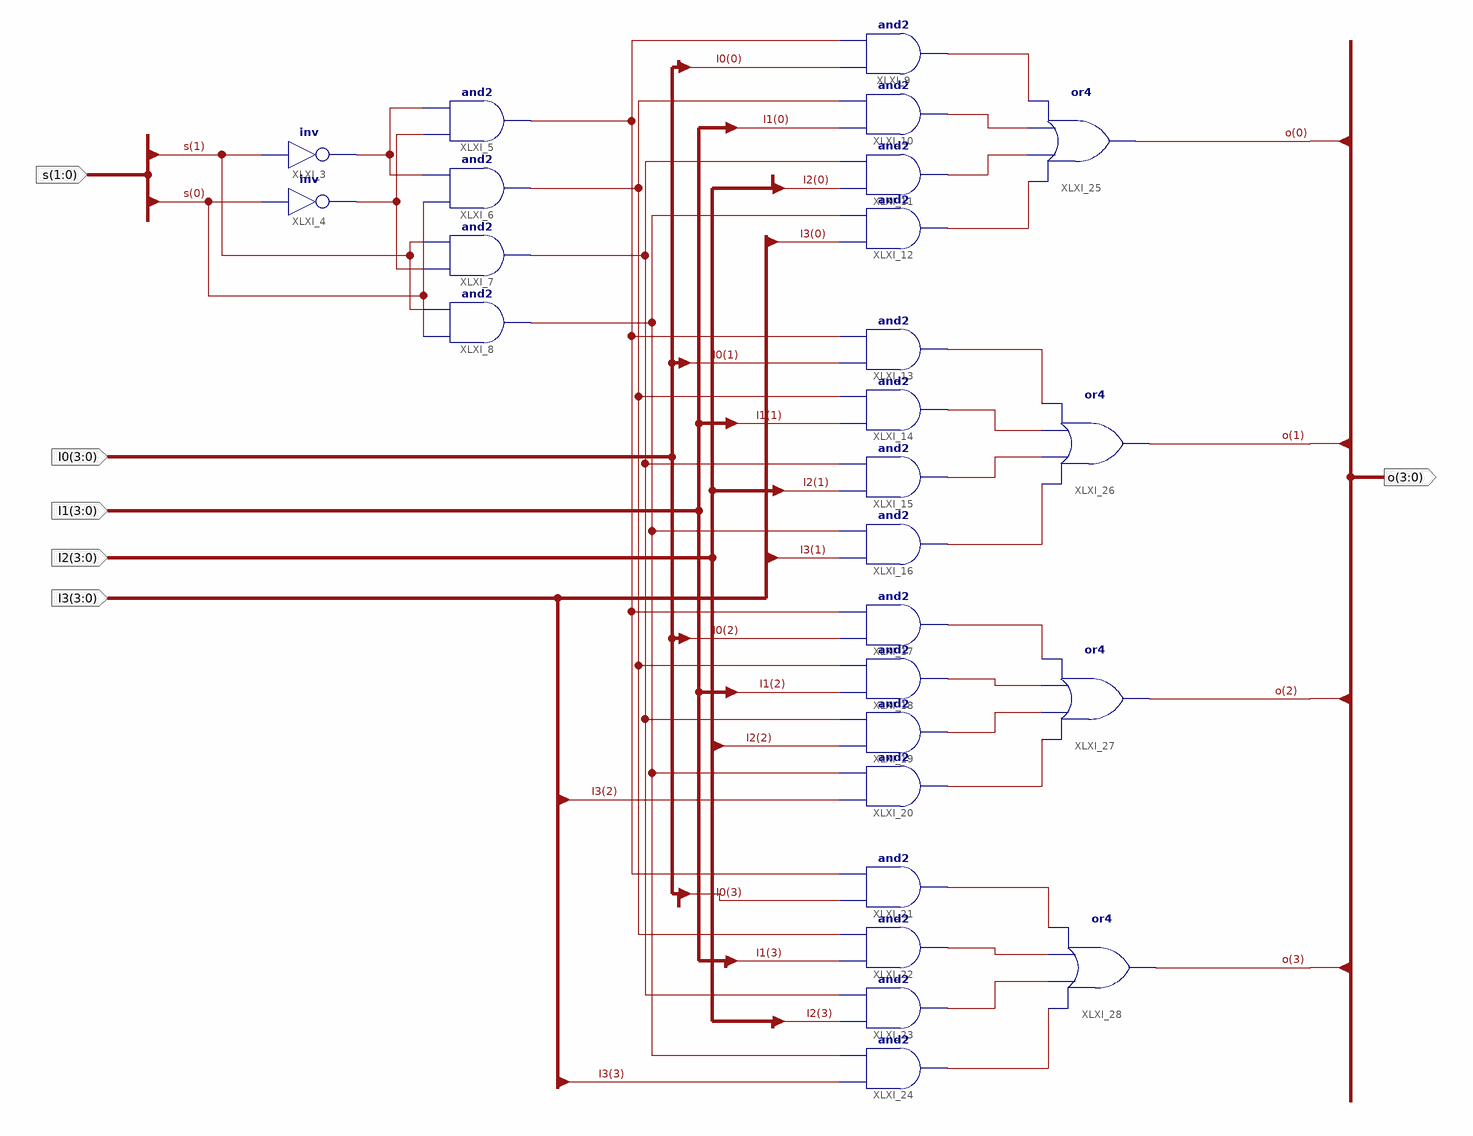
[diagram p0: schematic sheet 1]
// Xilinx ISE schematic MUX4T1_4.sch (kintex7) as structural Verilog: 26 symbols, 6 ports
module MUX4T1_4 (
  input  [1:0] s,
  input  [3:0] I1,
  input  [3:0] I2,
  input  [3:0] I3,
  input  [3:0] I0,
  output [3:0] o
);

  wire LE0, LE1, LE2, LE3, Ns0, Ns1, XLXN_102, XLXN_103, XLXN_104, XLXN_107, XLXN_108, XLXN_109, XLXN_110,
       XLXN_111, XLXN_112, XLXN_113, XLXN_114, XLXN_115, XLXN_116, XLXN_117, XLXN_118, XLXN_119;

  not XLXI_3 (Ns1, s[1]);
  not XLXI_4 (Ns0, s[0]);
  and XLXI_5 (LE0, Ns0, Ns1);
  and XLXI_6 (LE1, s[0], Ns1);
  and XLXI_7 (LE2, Ns0, s[1]);
  and XLXI_8 (LE3, s[0], s[1]);
  and XLXI_9 (XLXN_102, I0[0], LE0);
  and XLXI_10 (XLXN_103, I1[0], LE1);
  and XLXI_11 (XLXN_104, I2[0], LE2);
  and XLXI_12 (XLXN_107, I3[0], LE3);
  and XLXI_13 (XLXN_108, I0[1], LE0);
  and XLXI_14 (XLXN_109, I1[1], LE1);
  and XLXI_15 (XLXN_110, I2[1], LE2);
  and XLXI_16 (XLXN_111, I3[1], LE3);
  and XLXI_17 (XLXN_112, I0[2], LE0);
  and XLXI_18 (XLXN_113, I1[2], LE1);
  and XLXI_19 (XLXN_114, I2[2], LE2);
  and XLXI_20 (XLXN_115, I3[2], LE3);
  and XLXI_21 (XLXN_116, I0[3], LE0);
  and XLXI_22 (XLXN_117, I1[3], LE1);
  and XLXI_23 (XLXN_118, I2[3], LE2);
  and XLXI_24 (XLXN_119, I3[3], LE3);
  or XLXI_25 (o[0], XLXN_107, XLXN_104, XLXN_103, XLXN_102);
  or XLXI_26 (o[1], XLXN_111, XLXN_110, XLXN_109, XLXN_108);
  or XLXI_27 (o[2], XLXN_115, XLXN_114, XLXN_113, XLXN_112);
  or XLXI_28 (o[3], XLXN_119, XLXN_118, XLXN_117, XLXN_116);
endmodule
